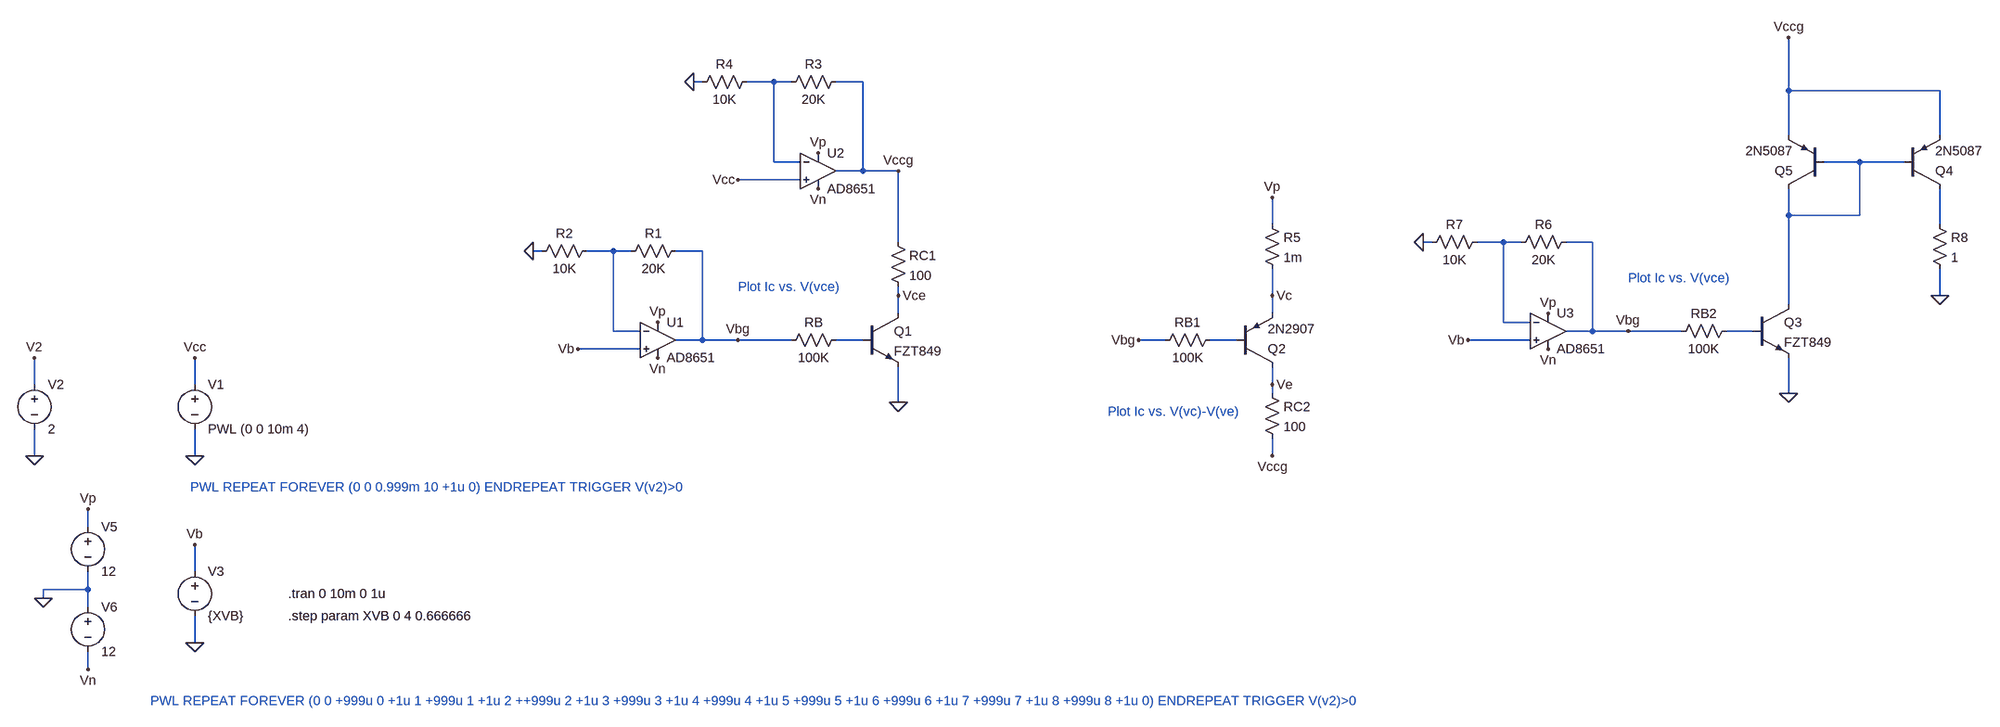
[diagram p0: schematic bjt_curve_trace.asc]
bjt_curve_trace.asc, the LTspice schematic file:
Version 4
SHEET 1 3476 680
WIRE 1040 -464 1024 -464
WIRE 1168 -464 1120 -464
WIRE 1200 -464 1168 -464
WIRE 1328 -464 1280 -464
WIRE 3088 -448 3088 -544
WIRE 3360 -448 3088 -448
WIRE 3088 -368 3088 -448
WIRE 3360 -368 3360 -448
WIRE 1168 -320 1168 -464
WIRE 1216 -320 1168 -320
WIRE 3216 -320 3152 -320
WIRE 3296 -320 3216 -320
WIRE 1328 -304 1328 -464
WIRE 1328 -304 1280 -304
WIRE 1392 -304 1328 -304
WIRE 1216 -288 1104 -288
WIRE 3088 -224 3088 -272
WIRE 3216 -224 3216 -320
WIRE 3216 -224 3088 -224
WIRE 2064 -208 2064 -256
WIRE 3360 -208 3360 -272
WIRE 1392 -176 1392 -304
WIRE 2448 -176 2432 -176
WIRE 2576 -176 2528 -176
WIRE 2608 -176 2576 -176
WIRE 2736 -176 2688 -176
WIRE 752 -160 736 -160
WIRE 880 -160 832 -160
WIRE 912 -160 880 -160
WIRE 1040 -160 992 -160
WIRE 1392 -80 1392 -96
WIRE 2064 -80 2064 -128
WIRE 3360 -80 3360 -128
WIRE 3088 -64 3088 -224
WIRE 1392 -48 1392 -80
WIRE 2064 -48 2064 -80
WIRE 2576 -32 2576 -176
WIRE 2624 -32 2576 -32
WIRE 880 -16 880 -160
WIRE 928 -16 880 -16
WIRE 2736 -16 2736 -176
WIRE 2736 -16 2688 -16
WIRE 2800 -16 2736 -16
WIRE 2896 -16 2800 -16
WIRE 3024 -16 2976 -16
WIRE 1040 0 1040 -160
WIRE 1040 0 992 0
WIRE 1104 0 1040 0
WIRE 1200 0 1104 0
WIRE 1328 0 1280 0
WIRE 1872 0 1824 0
WIRE 2000 0 1952 0
WIRE 2624 0 2512 0
WIRE 928 16 816 16
WIRE -160 80 -160 32
WIRE 128 80 128 32
WIRE 2064 80 2064 48
WIRE 2064 96 2064 80
WIRE 3088 96 3088 32
WIRE 1392 112 1392 48
WIRE -160 208 -160 160
WIRE 128 208 128 160
WIRE 2064 208 2064 176
WIRE -64 336 -64 304
WIRE 128 416 128 368
WIRE -64 448 -64 416
WIRE -64 448 -144 448
WIRE -144 464 -144 448
WIRE -64 480 -64 448
WIRE 128 544 128 496
WIRE -64 592 -64 560
FLAG -160 32 V2
FLAG -160 208 0
FLAG 128 32 Vcc
FLAG 128 208 0
FLAG 128 368 Vb
FLAG 128 544 0
FLAG 1392 112 0
FLAG 1104 -288 Vcc
FLAG 816 16 Vb
FLAG 1392 -80 Vce
FLAG 2064 -80 Vc
FLAG 2064 80 Ve
FLAG -144 464 0
FLAG -64 304 Vp
FLAG -64 592 Vn
FLAG 736 -160 0
FLAG 960 -32 Vp
FLAG 960 32 Vn
FLAG 1024 -464 0
FLAG 1248 -336 Vp
FLAG 1248 -272 Vn
FLAG 1392 -304 Vccg
FLAG 2064 208 Vccg
FLAG 1104 0 Vbg
FLAG 1824 0 Vbg
FLAG 2064 -256 Vp
FLAG 3088 96 0
FLAG 2512 0 Vb
FLAG 2432 -176 0
FLAG 2656 -48 Vp
FLAG 2656 16 Vn
FLAG 2800 -16 Vbg
FLAG 3088 -544 Vccg
FLAG 3360 -80 0
SYMBOL voltage 128 64 R0
WINDOW 123 0 0 Left 0
WINDOW 39 0 0 Left 0
SYMATTR InstName V1
SYMATTR Value PWL (0 0 10m 4)
SYMBOL voltage -160 64 R0
SYMATTR InstName V2
SYMATTR Value 2
SYMBOL voltage 128 400 R0
SYMATTR InstName V3
SYMATTR Value {XVB}
SYMBOL res 1376 -192 R0
SYMATTR InstName RC1
SYMATTR Value 100
SYMBOL res 1296 -16 R90
WINDOW 0 0 56 VBottom 2
WINDOW 3 32 56 VTop 2
SYMATTR InstName RB
SYMATTR Value 100K
SYMBOL npn 1328 -48 R0
SYMATTR InstName Q1
SYMATTR Value FZT849
SYMBOL pnp 2000 48 M180
SYMATTR InstName Q2
SYMATTR Value 2N2907
SYMBOL res 1968 -16 R90
WINDOW 0 0 56 VBottom 2
WINDOW 3 32 56 VTop 2
SYMATTR InstName RB1
SYMATTR Value 100K
SYMBOL res 2048 80 R0
SYMATTR InstName RC2
SYMATTR Value 100
SYMBOL voltage -64 320 R0
SYMATTR InstName V5
SYMATTR Value 12
SYMBOL voltage -64 464 R0
SYMATTR InstName V6
SYMATTR Value 12
SYMBOL res 1008 -176 R90
WINDOW 0 0 56 VBottom 2
WINDOW 3 32 56 VTop 2
SYMATTR InstName R1
SYMATTR Value 20K
SYMATTR SpiceLine tol=1 pwr=0.1
SYMBOL res 848 -176 R90
WINDOW 0 0 56 VBottom 2
WINDOW 3 32 56 VTop 2
SYMATTR InstName R2
SYMATTR Value 10K
SYMATTR SpiceLine tol=1 pwr=0.1
SYMBOL OpAmps\\AD8651 960 -64 R0
SYMATTR InstName U1
SYMBOL res 1296 -480 R90
WINDOW 0 0 56 VBottom 2
WINDOW 3 32 56 VTop 2
SYMATTR InstName R3
SYMATTR Value 20K
SYMATTR SpiceLine tol=1 pwr=0.1
SYMBOL res 1136 -480 R90
WINDOW 0 0 56 VBottom 2
WINDOW 3 32 56 VTop 2
SYMATTR InstName R4
SYMATTR Value 10K
SYMATTR SpiceLine tol=1 pwr=0.1
SYMBOL OpAmps\\AD8651 1248 -368 R0
SYMATTR InstName U2
SYMBOL res 2048 -224 R0
SYMATTR InstName R5
SYMATTR Value 1m
SYMBOL res 2992 -32 R90
WINDOW 0 0 56 VBottom 2
WINDOW 3 32 56 VTop 2
SYMATTR InstName RB2
SYMATTR Value 100K
SYMBOL npn 3024 -64 R0
SYMATTR InstName Q3
SYMATTR Value FZT849
SYMBOL res 2704 -192 R90
WINDOW 0 0 56 VBottom 2
WINDOW 3 32 56 VTop 2
SYMATTR InstName R6
SYMATTR Value 20K
SYMATTR SpiceLine tol=1 pwr=0.1
SYMBOL res 2544 -192 R90
WINDOW 0 0 56 VBottom 2
WINDOW 3 32 56 VTop 2
SYMATTR InstName R7
SYMATTR Value 10K
SYMATTR SpiceLine tol=1 pwr=0.1
SYMBOL OpAmps\\AD8651 2656 -80 R0
SYMATTR InstName U3
SYMBOL pnp 3296 -272 M180
SYMATTR InstName Q4
SYMATTR Value 2N5087
SYMBOL pnp 3152 -272 R180
SYMATTR InstName Q5
SYMATTR Value 2N5087
SYMBOL res 3344 -224 R0
SYMATTR InstName R8
SYMATTR Value 1
SYMATTR SpiceLine tol=1 pwr=0.1
TEXT 296 456 Left 2 !.tran 0 10m 0 1u
TEXT 48 648 Left 2 ;PWL REPEAT FOREVER (0 0 +999u 0 +1u 1 +999u 1 +1u 2 ++999u 2 +1u 3 +999u 3 +1u 4 +999u 4 +1u 5 +999u 5 +1u 6 +999u 6 +1u 7 +999u 7 +1u 8 +999u 8 +1u 0) ENDREPEAT TRIGGER V(v2)>0
TEXT 296 496 Left 2 !.step param XVB 0 4 0.666666
TEXT 120 264 Left 2 ;PWL REPEAT FOREVER (0 0 0.999m 10 +1u 0) ENDREPEAT TRIGGER V(v2)>0
TEXT 1104 -96 Left 2 ;Plot Ic vs. V(vce)
TEXT 1768 128 Left 2 ;Plot Ic vs. V(vc)-V(ve)
TEXT 2800 -112 Left 2 ;Plot Ic vs. V(vce)

The netlist it stands for:
* bjt_curve_trace.asc
V1 Vcc 0 PWL (0 0 10m 4)
V2 V2 0 2
V3 Vb 0 {XVB}
RC1 Vccg Vce 100
RB N007 Vbg 100K
Q1 Vce N007 0 0 FZT849
Q2 Ve N008 Vc 0 2N2907
RB1 N008 Vbg 100K
RC2 Ve Vccg 100
V5 Vp 0 12
V6 0 Vn 12
R1 Vbg N005 20K tol=1 pwr=0.1
R2 N005 0 10K tol=1 pwr=0.1
XU1 Vb N005 Vp Vn Vbg AD8651  ; pins In+ In- V+ V- OUT
R3 Vccg N001 20K tol=1 pwr=0.1
R4 N001 0 10K tol=1 pwr=0.1
XU2 Vcc N001 Vp Vn Vccg AD8651  ; pins In+ In- V+ V- OUT
R5 Vp Vc 1m
RB2 N006 Vbg 100K
Q3 N002 N006 0 0 FZT849
R6 Vbg N004 20K tol=1 pwr=0.1
R7 N004 0 10K tol=1 pwr=0.1
XU3 Vb N004 Vp Vn Vbg AD8651  ; pins In+ In- V+ V- OUT
Q4 N003 N002 Vccg 0 2N5087
Q5 N002 N002 Vccg 0 2N5087
R8 N003 0 1 tol=1 pwr=0.1
.model NPN NPN
.model PNP PNP
.lib standard.bjt
.tran 0 10m 0 1u
* PWL REPEAT FOREVER (0 0 +999u 0 +1u 1 +999u 1 +1u 2 ++999u 2 +1u 3 +999u 3 +1u 4 +999u 4 +1u 5 +999u 5 +1u 6 +999u 6 +1u 7 +999u 7 +1u 8 +999u 8 +1u 0) ENDREPEAT TRIGGER V(v2)>0
.step param XVB 0 4 0.666666
* PWL REPEAT FOREVER (0 0 0.999m 10 +1u 0) ENDREPEAT TRIGGER V(v2)>0
* Plot Ic vs. V(vce)
* Plot Ic vs. V(vc)-V(ve)
* Plot Ic vs. V(vce)
.backanno
.end